# Altium schematic sheet Connectors.SchDoc: Connectors
size A3; Date: 18/06/2014; DrawnBy: J. Gabriel R.E.; Organization: Seven Solutions S.L.; Address1: C/Baza, Parcela 19, Nave 3; Address2: Polнgono Ind. Juncaril; Address3: 18210-Peligros-Granada; Address4: Spain; Revision: 3.4; SheetNumber: 15; SheetTotal: 23; WebAddress: www.sevensols.com; Project: White Rabbit; ProjectName: Project Name
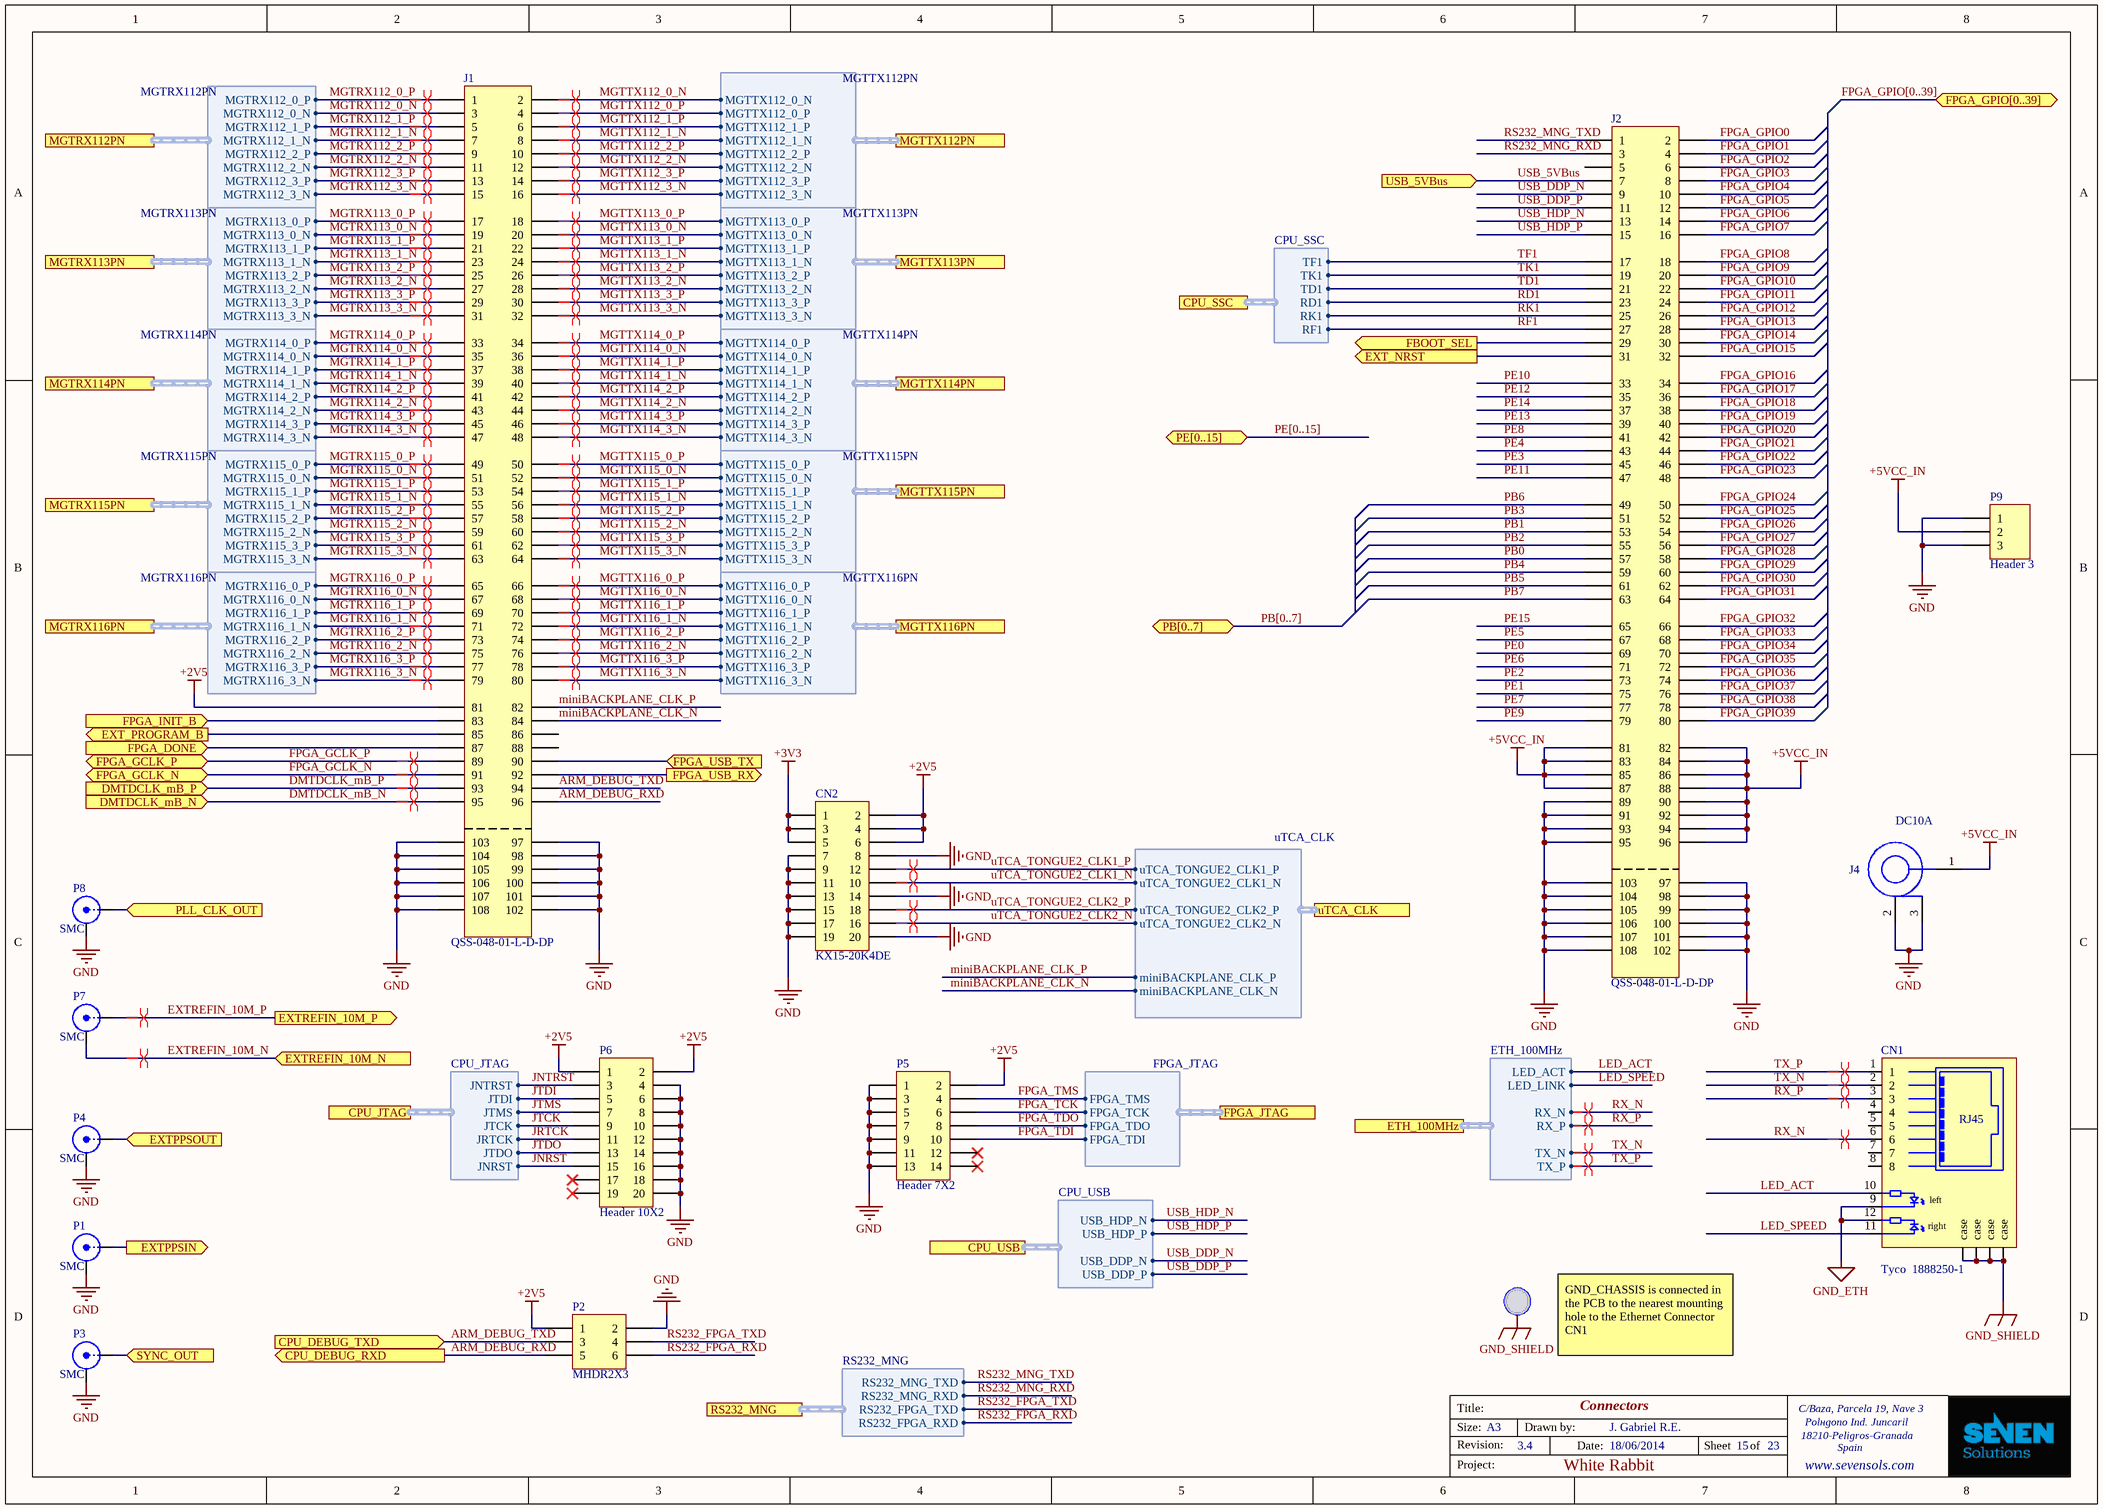
[diagram p0: Connectors.SchDoc]

## Parts
CN1  Tyco  1888250-1  [TYCO_ETHERNET_1888250-1]
CN2  KX15-20K4DE  [JAE_KX15_20P]
J1  QSS-048-01-L-D-DP  [QSS-048-01-X-D-DP-A]
J2  QSS-048-01-L-D-DP  [QSS-048-01-X-D-DP-A]
J4  DC10A  [dc-10]
P1  SMC  [SMB_V-RJ45]
P2  MHDR2X3  [HDR2x3_M22]
P3  SMC  [SMB_V-RJ45]
P4  SMC  [SMB_V-RJ45]
P5  Header 7X2  [CONN_HDR_SMD_2mm_2x7]
P6  Header 10X2  [HDR2X10_SBH11]
P7  SMC  [SMB_V-RJ45]
P8  SMC  [SMB_V-RJ45]
P9  Header 3  [HDR1x3_BG055]

## Ports
CPU_DEBUG_RXD (out), CPU_DEBUG_TXD (in), CPU_JTAG (harness CPU_JTAG), CPU_SSC (harness CPU_SSC), CPU_USB (harness CPU_USB), DMTDCLK_mB_N (in), DMTDCLK_mB_P (in), ETH_100MHz (harness ETH_100MHz), EXT_NRST (out), EXT_PROGRAM_B (out), EXTPPSIN (out), EXTPPSOUT (in), EXTREFIN_10M_N (in), EXTREFIN_10M_P (out), FBOOT_SEL (out), FPGA_DONE (in), FPGA_GCLK_N (bidir), FPGA_GCLK_P (bidir), FPGA_GPIO[0..39] (bidir), FPGA_INIT_B (in), FPGA_JTAG (harness FPGA_JTAG), FPGA_USB_RX (out), FPGA_USB_TX (in), MGTRX112PN (harness MGTRX112PN), MGTRX113PN (harness MGTRX113PN), MGTRX114PN (harness MGTRX114PN), MGTRX115PN (harness MGTRX115PN), MGTRX116PN (harness MGTRX116PN), MGTTX112PN (harness MGTTX112PN), MGTTX113PN (harness MGTTX113PN), MGTTX114PN (harness MGTTX114PN), MGTTX115PN (harness MGTTX115PN), MGTTX116PN (harness MGTTX116PN), PB[0..7] (bidir), PE[0..15] (bidir), PLL_CLK_OUT (in), RS232_MNG (harness RS232_MNG), SYNC_OUT (in), USB_5VBus (in), uTCA_CLK (harness uTCA_CLK)

## Harnesses
MGTTX112PN: MGTTX112_0_P, MGTTX112_0_N, MGTTX112_1_P, MGTTX112_1_N, MGTTX112_2_P, MGTTX112_2_N, MGTTX112_3_P, MGTTX112_3_N
MGTTX113PN: MGTTX113_0_P, MGTTX113_0_N, MGTTX113_1_P, MGTTX113_1_N, MGTTX113_2_P, MGTTX113_2_N, MGTTX113_3_P, MGTTX113_3_N
MGTTX114PN: MGTTX114_0_P, MGTTX114_0_N, MGTTX114_1_P, MGTTX114_1_N, MGTTX114_2_P, MGTTX114_2_N, MGTTX114_3_P, MGTTX114_3_N
MGTTX115PN: MGTTX115_0_P, MGTTX115_0_N, MGTTX115_1_P, MGTTX115_1_N, MGTTX115_2_P, MGTTX115_2_N, MGTTX115_3_P, MGTTX115_3_N
MGTTX116PN: MGTTX116_0_P, MGTTX116_0_N, MGTTX116_1_P, MGTTX116_1_N, MGTTX116_2_P, MGTTX116_2_N, MGTTX116_3_P, MGTTX116_3_N
MGTRX112PN: MGTRX112_0_P, MGTRX112_0_N, MGTRX112_1_P, MGTRX112_1_N, MGTRX112_2_P, MGTRX112_2_N, MGTRX112_3_P, MGTRX112_3_N
MGTRX113PN: MGTRX113_0_P, MGTRX113_0_N, MGTRX113_1_P, MGTRX113_1_N, MGTRX113_2_P, MGTRX113_2_N, MGTRX113_3_P, MGTRX113_3_N
MGTRX114PN: MGTRX114_0_P, MGTRX114_0_N, MGTRX114_1_P, MGTRX114_1_N, MGTRX114_2_P, MGTRX114_2_N, MGTRX114_3_P, MGTRX114_3_N
MGTRX115PN: MGTRX115_0_P, MGTRX115_0_N, MGTRX115_1_P, MGTRX115_1_N, MGTRX115_2_P, MGTRX115_2_N, MGTRX115_3_P, MGTRX115_3_N
MGTRX116PN: MGTRX116_0_P, MGTRX116_0_N, MGTRX116_1_P, MGTRX116_1_N, MGTRX116_2_P, MGTRX116_2_N, MGTRX116_3_P, MGTRX116_3_N
ETH_100MHz: RX_P, TX_P, TX_N, RX_N, LED_LINK, LED_ACT
CPU_JTAG: JNRST, JTDO, JRTCK, JTCK, JTMS, JTDI, JNTRST
FPGA_JTAG: FPGA_TMS, FPGA_TCK, FPGA_TDI, FPGA_TDO
RS232_MNG: RS232_MNG_TXD, RS232_FPGA_TXD, RS232_MNG_RXD, RS232_FPGA_RXD
uTCA_CLK: uTCA_TONGUE2_CLK1_P, uTCA_TONGUE2_CLK1_N, uTCA_TONGUE2_CLK2_P, uTCA_TONGUE2_CLK2_N, miniBACKPLANE_CLK_P, miniBACKPLANE_CLK_N
CPU_USB: USB_HDP_P, USB_HDP_N, USB_DDP_P, USB_DDP_N
CPU_SSC: TF1, TK1, TD1, RD1, RK1, RF1

## Nets
+2V5: CN2.2 CN2.4 CN2.6 J1.81 P2.1 P5.2 P6.1 P6.2
+3V3: CN2.1 CN2.3 CN2.5
+5VCC_IN: J2.81 J2.82 J2.83 J2.84 J2.85 J2.86 J2.87 J2.88 J2.90 J2.92 J2.94 J2.96 J4.1(P1) P9.2
GND: CN2.7 CN2.8 CN2.9 CN2.11 CN2.13 CN2.14 CN2.15 CN2.17 CN2.19 CN2.20 J1.97 J1.98 J1.99 J1.100 J1.101 J1.102 J1.103 J1.104 J1.105 J1.106 J1.107 J1.108 J2.89 J2.91 J2.93 J2.95 J2.97 J2.98 J2.99 J2.100 J2.101 J2.102 J2.103 J2.104 J2.105 J2.106 J2.107 J2.108 J4.2(P2) J4.3(P3) P1.2(Y) P2.2 P3.2(Y) P4.2(Y) P5.1 P5.3 P5.5 P5.7 P5.9 P5.11 P5.13 P6.4 P6.6 P6.8 P6.10 P6.12 P6.14 P6.16 P6.18 P6.20 P8.2(Y) P9.1 P9.3
GND_ETH: CN1.9(D2) CN1.12(D3)
GND_SHIELD: CN1.0(case)
ARM_DEBUG_RXD: J1.96 P2.5 ; port CPU_DEBUG_RXD
ARM_DEBUG_TXD: J1.94 P2.3 ; port CPU_DEBUG_TXD
DMTDCLK_mB_N: J1.95 ; port DMTDCLK_mB_N
DMTDCLK_mB_P: J1.93 ; port DMTDCLK_mB_P
EXT_NRST: J2.31 ; port EXT_NRST
EXT_PROGRAM_B: J1.85 ; port EXT_PROGRAM_B
EXTPPSIN: P1.1(X) ; port EXTPPSIN
EXTPPSOUT: P4.1(X) ; port EXTPPSOUT
EXTREFIN_10M_N: P7.2(Y) ; port EXTREFIN_10M_N
EXTREFIN_10M_P: P7.1(X) ; port EXTREFIN_10M_P
FBOOT_SEL: J2.29 ; port FBOOT_SEL
FPGA_DONE: J1.87 ; port FPGA_DONE
FPGA_GCLK_N: J1.91 ; port FPGA_GCLK_N
FPGA_GCLK_P: J1.89 ; port FPGA_GCLK_P
FPGA_GPIO0: J2.2
FPGA_GPIO1: J2.4
FPGA_GPIO2: J2.6
FPGA_GPIO3: J2.8
FPGA_GPIO4: J2.10
FPGA_GPIO5: J2.12
FPGA_GPIO6: J2.14
FPGA_GPIO7: J2.16
FPGA_GPIO8: J2.18
FPGA_GPIO9: J2.20
FPGA_GPIO10: J2.22
FPGA_GPIO11: J2.24
FPGA_GPIO12: J2.26
FPGA_GPIO13: J2.28
FPGA_GPIO14: J2.30
FPGA_GPIO15: J2.32
FPGA_GPIO16: J2.34
FPGA_GPIO17: J2.36
FPGA_GPIO18: J2.38
FPGA_GPIO19: J2.40
FPGA_GPIO20: J2.42
FPGA_GPIO21: J2.44
FPGA_GPIO22: J2.46
FPGA_GPIO23: J2.48
FPGA_GPIO24: J2.50
FPGA_GPIO25: J2.52
FPGA_GPIO26: J2.54
FPGA_GPIO27: J2.56
FPGA_GPIO28: J2.58
FPGA_GPIO29: J2.60
FPGA_GPIO30: J2.62
FPGA_GPIO31: J2.64
FPGA_GPIO32: J2.66
FPGA_GPIO33: J2.68
FPGA_GPIO34: J2.70
FPGA_GPIO35: J2.72
FPGA_GPIO36: J2.74
FPGA_GPIO37: J2.76
FPGA_GPIO38: J2.78
FPGA_GPIO39: J2.80
FPGA_INIT_B: J1.83 ; port FPGA_INIT_B
FPGA_TCK: P5.6 ; port FPGA_JTAG.FPGA_TCK
FPGA_TDI: P5.10 ; port FPGA_JTAG.FPGA_TDI
FPGA_TDO: P5.8 ; port FPGA_JTAG.FPGA_TDO
FPGA_TMS: P5.4 ; port FPGA_JTAG.FPGA_TMS
FPGA_USB_RX: J1.92 ; port FPGA_USB_RX
FPGA_USB_TX: J1.90 ; port FPGA_USB_TX
JNRST: P6.15 ; port CPU_JTAG.JNRST
JNTRST: P6.3 ; port CPU_JTAG.JNTRST
JRTCK: P6.11 ; port CPU_JTAG.JRTCK
JTCK: P6.9 ; port CPU_JTAG.JTCK
JTDI: P6.5 ; port CPU_JTAG.JTDI
JTDO: P6.13 ; port CPU_JTAG.JTDO
JTMS: P6.7 ; port CPU_JTAG.JTMS
LED_ACT: CN1.10(D1) ; port ETH_100MHz.LED_ACT
LED_SPEED: CN1.11(D4) ; port ETH_100MHz.LED_LINK
MGTRX112_0_N: J1.3 ; port MGTRX112PN.MGTRX112_0_N
MGTRX112_0_P: J1.1 ; port MGTRX112PN.MGTRX112_0_P
MGTRX112_1_N: J1.7 ; port MGTRX112PN.MGTRX112_1_N
MGTRX112_1_P: J1.5 ; port MGTRX112PN.MGTRX112_1_P
MGTRX112_2_N: J1.11 ; port MGTRX112PN.MGTRX112_2_N
MGTRX112_2_P: J1.9 ; port MGTRX112PN.MGTRX112_2_P
MGTRX112_3_N: J1.15 ; port MGTRX112PN.MGTRX112_3_N
MGTRX112_3_P: J1.13 ; port MGTRX112PN.MGTRX112_3_P
MGTRX113_0_N: J1.19 ; port MGTRX113PN.MGTRX113_0_N
MGTRX113_0_P: J1.17 ; port MGTRX113PN.MGTRX113_0_P
MGTRX113_1_N: J1.23 ; port MGTRX113PN.MGTRX113_1_N
MGTRX113_1_P: J1.21 ; port MGTRX113PN.MGTRX113_1_P
MGTRX113_2_N: J1.27 ; port MGTRX113PN.MGTRX113_2_N
MGTRX113_2_P: J1.25 ; port MGTRX113PN.MGTRX113_2_P
MGTRX113_3_N: J1.31 ; port MGTRX113PN.MGTRX113_3_N
MGTRX113_3_P: J1.29 ; port MGTRX113PN.MGTRX113_3_P
MGTRX114_0_N: J1.35 ; port MGTRX114PN.MGTRX114_0_N
MGTRX114_0_P: J1.33 ; port MGTRX114PN.MGTRX114_0_P
MGTRX114_1_N: J1.39 ; port MGTRX114PN.MGTRX114_1_N
MGTRX114_1_P: J1.37 ; port MGTRX114PN.MGTRX114_1_P
MGTRX114_2_N: J1.43 ; port MGTRX114PN.MGTRX114_2_N
MGTRX114_2_P: J1.41 ; port MGTRX114PN.MGTRX114_2_P
MGTRX114_3_N: J1.47 ; port MGTRX114PN.MGTRX114_3_N
MGTRX114_3_P: J1.45 ; port MGTRX114PN.MGTRX114_3_P
MGTRX115_0_N: J1.51 ; port MGTRX115PN.MGTRX115_0_N
MGTRX115_0_P: J1.49 ; port MGTRX115PN.MGTRX115_0_P
MGTRX115_1_N: J1.55 ; port MGTRX115PN.MGTRX115_1_N
MGTRX115_1_P: J1.53 ; port MGTRX115PN.MGTRX115_1_P
MGTRX115_2_N: J1.59 ; port MGTRX115PN.MGTRX115_2_N
MGTRX115_2_P: J1.57 ; port MGTRX115PN.MGTRX115_2_P
MGTRX115_3_N: J1.63 ; port MGTRX115PN.MGTRX115_3_N
MGTRX115_3_P: J1.61 ; port MGTRX115PN.MGTRX115_3_P
MGTRX116_0_N: J1.67 ; port MGTRX116PN.MGTRX116_0_N
MGTRX116_0_P: J1.65 ; port MGTRX116PN.MGTRX116_0_P
MGTRX116_1_N: J1.71 ; port MGTRX116PN.MGTRX116_1_N
MGTRX116_1_P: J1.69 ; port MGTRX116PN.MGTRX116_1_P
MGTRX116_2_N: J1.75 ; port MGTRX116PN.MGTRX116_2_N
MGTRX116_2_P: J1.73 ; port MGTRX116PN.MGTRX116_2_P
MGTRX116_3_N: J1.79 ; port MGTRX116PN.MGTRX116_3_N
MGTRX116_3_P: J1.77 ; port MGTRX116PN.MGTRX116_3_P
MGTTX112_0_N: J1.2 ; port MGTTX112PN.MGTTX112_0_N
MGTTX112_0_P: J1.4 ; port MGTTX112PN.MGTTX112_0_P
MGTTX112_1_N: J1.8 ; port MGTTX112PN.MGTTX112_1_N
MGTTX112_1_P: J1.6 ; port MGTTX112PN.MGTTX112_1_P
MGTTX112_2_N: J1.12 ; port MGTTX112PN.MGTTX112_2_N
MGTTX112_2_P: J1.10 ; port MGTTX112PN.MGTTX112_2_P
MGTTX112_3_N: J1.16 ; port MGTTX112PN.MGTTX112_3_N
MGTTX112_3_P: J1.14 ; port MGTTX112PN.MGTTX112_3_P
MGTTX113_0_N: J1.20 ; port MGTTX113PN.MGTTX113_0_N
MGTTX113_0_P: J1.18 ; port MGTTX113PN.MGTTX113_0_P
MGTTX113_1_N: J1.24 ; port MGTTX113PN.MGTTX113_1_N
MGTTX113_1_P: J1.22 ; port MGTTX113PN.MGTTX113_1_P
MGTTX113_2_N: J1.28 ; port MGTTX113PN.MGTTX113_2_N
MGTTX113_2_P: J1.26 ; port MGTTX113PN.MGTTX113_2_P
MGTTX113_3_N: J1.32 ; port MGTTX113PN.MGTTX113_3_N
MGTTX113_3_P: J1.30 ; port MGTTX113PN.MGTTX113_3_P
MGTTX114_0_N: J1.36 ; port MGTTX114PN.MGTTX114_0_N
MGTTX114_0_P: J1.34 ; port MGTTX114PN.MGTTX114_0_P
MGTTX114_1_N: J1.40 ; port MGTTX114PN.MGTTX114_1_N
MGTTX114_1_P: J1.38 ; port MGTTX114PN.MGTTX114_1_P
MGTTX114_2_N: J1.44 ; port MGTTX114PN.MGTTX114_2_N
MGTTX114_2_P: J1.42 ; port MGTTX114PN.MGTTX114_2_P
MGTTX114_3_N: J1.48 ; port MGTTX114PN.MGTTX114_3_N
MGTTX114_3_P: J1.46 ; port MGTTX114PN.MGTTX114_3_P
MGTTX115_0_N: J1.52 ; port MGTTX115PN.MGTTX115_0_N
MGTTX115_0_P: J1.50 ; port MGTTX115PN.MGTTX115_0_P
MGTTX115_1_N: J1.56 ; port MGTTX115PN.MGTTX115_1_N
MGTTX115_1_P: J1.54 ; port MGTTX115PN.MGTTX115_1_P
MGTTX115_2_N: J1.60 ; port MGTTX115PN.MGTTX115_2_N
MGTTX115_2_P: J1.58 ; port MGTTX115PN.MGTTX115_2_P
MGTTX115_3_N: J1.64 ; port MGTTX115PN.MGTTX115_3_N
MGTTX115_3_P: J1.62 ; port MGTTX115PN.MGTTX115_3_P
MGTTX116_0_N: J1.68 ; port MGTTX116PN.MGTTX116_0_N
MGTTX116_0_P: J1.66 ; port MGTTX116PN.MGTTX116_0_P
MGTTX116_1_N: J1.72 ; port MGTTX116PN.MGTTX116_1_N
MGTTX116_1_P: J1.70 ; port MGTTX116PN.MGTTX116_1_P
MGTTX116_2_N: J1.76 ; port MGTTX116PN.MGTTX116_2_N
MGTTX116_2_P: J1.74 ; port MGTTX116PN.MGTTX116_2_P
MGTTX116_3_N: J1.80 ; port MGTTX116PN.MGTTX116_3_N
MGTTX116_3_P: J1.78 ; port MGTTX116PN.MGTTX116_3_P
miniBACKPLANE_CLK_N: J1.84 ; port uTCA_CLK.miniBACKPLANE_CLK_N
miniBACKPLANE_CLK_P: J1.82 ; port uTCA_CLK.miniBACKPLANE_CLK_P
PB0: J2.57
PB1: J2.53
PB2: J2.55
PB3: J2.51
PB4: J2.59
PB5: J2.61
PB6: J2.49
PB7: J2.63
PE0: J2.69
PE1: J2.75
PE2: J2.73
PE3: J2.45
PE4: J2.43
PE5: J2.67
PE6: J2.71
PE7: J2.77
PE8: J2.41
PE9: J2.79
PE10: J2.33
PE11: J2.47
PE12: J2.35
PE13: J2.39
PE14: J2.37
PE15: J2.65
PLL_CLK_OUT: P8.1(X) ; port PLL_CLK_OUT
RD1: J2.23 ; port CPU_SSC.RD1
RF1: J2.27 ; port CPU_SSC.RF1
RK1: J2.25 ; port CPU_SSC.RK1
RS232_FPGA_RXD: P2.6 ; port RS232_MNG.RS232_FPGA_RXD
RS232_FPGA_TXD: P2.4 ; port RS232_MNG.RS232_FPGA_TXD
RS232_MNG_RXD: J2.3 ; port RS232_MNG.RS232_MNG_RXD
RS232_MNG_TXD: J2.1 ; port RS232_MNG.RS232_MNG_TXD
RX_N: CN1.6 ; port ETH_100MHz.RX_N
RX_P: CN1.3 ; port ETH_100MHz.RX_P
SYNC_OUT: P3.1(X) ; port SYNC_OUT
TD1: J2.21 ; port CPU_SSC.TD1
TF1: J2.17 ; port CPU_SSC.TF1
TK1: J2.19 ; port CPU_SSC.TK1
TX_N: CN1.2 ; port ETH_100MHz.TX_N
TX_P: CN1.1 ; port ETH_100MHz.TX_P
USB_5VBus: J2.7 ; port USB_5VBus
USB_DDP_N: J2.9 ; port CPU_USB.USB_DDP_N
USB_DDP_P: J2.11 ; port CPU_USB.USB_DDP_P
USB_HDP_N: J2.13 ; port CPU_USB.USB_HDP_N
USB_HDP_P: J2.15 ; port CPU_USB.USB_HDP_P
uTCA_TONGUE2_CLK1_N: CN2.10 ; port uTCA_CLK.uTCA_TONGUE2_CLK1_N
uTCA_TONGUE2_CLK1_P: CN2.12 ; port uTCA_CLK.uTCA_TONGUE2_CLK1_P
uTCA_TONGUE2_CLK2_N: CN2.16 ; port uTCA_CLK.uTCA_TONGUE2_CLK2_N
uTCA_TONGUE2_CLK2_P: CN2.18 ; port uTCA_CLK.uTCA_TONGUE2_CLK2_P

Not connected (* = marked no-connect by the designer): CN1 4 5 7 8; J1 86 88; J2 5; P5 12* 14*; P6 17* 19*

## Buses and harness runs
bus FPGA_GPIO[0..39] = port FPGA_GPIO[0..39]
bus PB[0..7] = port PB[0..7]
bus PE[0..15] = port PE[0..15]

## Layout directives
differential pair: DMTDCLK_mB_N, DMTDCLK_mB_P, EXTREFIN_10M_N, EXTREFIN_10M_P, FPGA_GCLK_N, FPGA_GCLK_P, MGTRX112_0_N, MGTRX112_0_P, MGTRX112_1_N, MGTRX112_1_P, MGTRX112_2_N, MGTRX112_2_P, MGTRX112_3_N, MGTRX112_3_P, MGTRX113_0_N, MGTRX113_0_P, MGTRX113_1_N, MGTRX113_1_P, MGTRX113_2_N, MGTRX113_2_P, MGTRX113_3_N, MGTRX113_3_P, MGTRX114_0_N, MGTRX114_0_P, MGTRX114_1_N, MGTRX114_1_P, MGTRX114_2_N, MGTRX114_2_P, MGTRX114_3_N, MGTRX114_3_P, MGTRX115_0_N, MGTRX115_0_P, MGTRX115_1_N, MGTRX115_1_P, MGTRX115_2_N, MGTRX115_2_P, MGTRX115_3_N, MGTRX115_3_P, MGTRX116_0_N, MGTRX116_0_P, MGTRX116_1_N, MGTRX116_1_P, MGTRX116_2_N, MGTRX116_2_P, MGTRX116_3_N, MGTRX116_3_P, MGTTX112_0_N, MGTTX112_0_P, MGTTX112_1_N, MGTTX112_1_P, MGTTX112_2_N, MGTTX112_2_P, MGTTX112_3_N, MGTTX112_3_P, MGTTX113_0_N, MGTTX113_0_P, MGTTX113_1_N, MGTTX113_1_P, MGTTX113_2_N, MGTTX113_2_P, MGTTX113_3_N, MGTTX113_3_P, MGTTX114_0_N, MGTTX114_0_P, MGTTX114_1_N, MGTTX114_1_P, MGTTX114_2_N, MGTTX114_2_P, MGTTX114_3_N, MGTTX114_3_P, MGTTX115_0_N, MGTTX115_0_P, MGTTX115_1_N, MGTTX115_1_P, MGTTX115_2_N, MGTTX115_2_P, MGTTX115_3_N, MGTTX115_3_P, MGTTX116_0_N, MGTTX116_0_P, MGTTX116_1_N, MGTTX116_1_P, MGTTX116_2_N, MGTTX116_2_P, MGTTX116_3_N, MGTTX116_3_P, RX_N, RX_P, TX_N, TX_P, uTCA_TONGUE2_CLK1_N, uTCA_TONGUE2_CLK1_P, uTCA_TONGUE2_CLK2_N, uTCA_TONGUE2_CLK2_P

## Notes on the sheet
- GND_CHASSIS is connected in the PCB to the nearest mounting hole to the Ethernet Connector CN1
- Labels drawn without touching a wire or pin: GND_SHIELD
- Title:
- Size:
- Revision:
- A3
- Drawn by:
- Date:
- Sheet
- of
- Project:
- (in symbol CON_ETHERNET_TYCO_1888250-1) RJ45; left; right

## Library data of the parts
CN1 = CON_ETHERNET_TYCO_1888250-1: low profile uTCA Ethernet jack (RJ45); RefId: Mouser/571-1888250-1; Value: 1888250-1; Distributor1 PN: A98526-ND; Distributor1: Digikey
CN2 = KX15_20p: multipin B2B connector (plug); Manufacturer1: JAE Electronics; Distributor1: Digikey; Manufacturer1 PN: KX15-20K4DE; Distributor1 PN: 670-1305-ND
J2 = QSS-048-01-L-D-DP: High Speed Ground Plane Header
J4 = PWR_JACK: Power Jack 5A @ 12V; LEVEL: STD; Mounted: No; PKG_TYPE: PWR_JACK; Value: DC10A; Distributor1 PN: 224959; Distributor1: Farnell
P1 P3 P4 P7 P8 = SMB: SMB Straight Connector; Value: 152123; LatestRevisionDate: 17-Jul-2002; LatestRevisionNote: Re-released for DXP Platform.; Publisher: Altium Limited; Distributor1 PN: ACX1509-ND; Distributor1: Digikey
P2 = MHDR2X3: SMD Header, 3-Pin, Dual row, 2.54mm pitch; Manufacturer1 PN: M22-5320305; Manufacturer1: Harwin; Distributor1: Digikey; Distributor1 PN: 952-1340-ND
P5 = Header 7X2: Header, 7-Pin, Dual row, 2.0 mm pitch; Manufacturer1: Molex; Manufacturer1 PN: 0878321421; Value: SBH21-NBPN-D07-SM-BK; LatestRevisionDate: 17-Jul-2002; LatestRevisionNote: Re-released for DXP Platform.; Publisher: Altium Limited; Distributor1 PN: WM4231-ND; Distributor1: Digikey
P6 = Header 10X2: Header, 10-Pin, Dual row, 2.54mm pitch; Manufacturer: Sullis Connectors; Value: SBH11-PBPC-D10-ST-BK; LatestRevisionDate: 17-Jul-2002; LatestRevisionNote: Re-released for DXP Platform.; Publisher: Altium Limited; Distributor1 PN: S9172-ND; Distributor1: Digikey
P9 = Header 3: Header, 3-Pin; Manufacturer1: GLOBAL CONNECTOR TECHNOLOGY; Manufacturer1 PN: BG055-03A-1-0450-0530-0350-L-G; Mounted: No; LatestRevisionDate: 17-Jul-2002; LatestRevisionNote: Re-released for DXP Platform.; Publisher: Altium Limited; Distributor1 PN: 1798981; Distributor1: Farnell